# EasyEDA Pro project SCH_and_PCB.epro, board PCB_PCB_电磁感应_2023-06-19
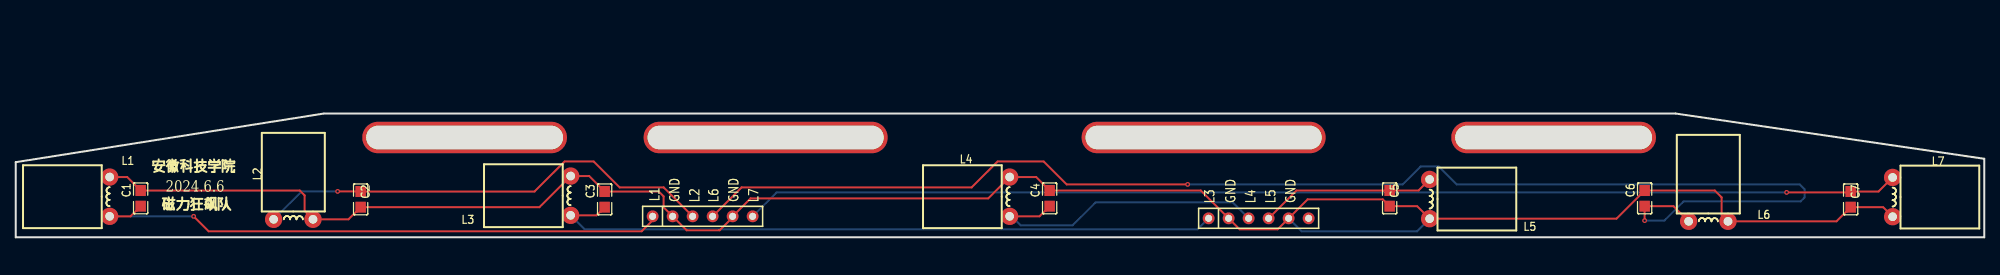
[diagram p6: board, top side]
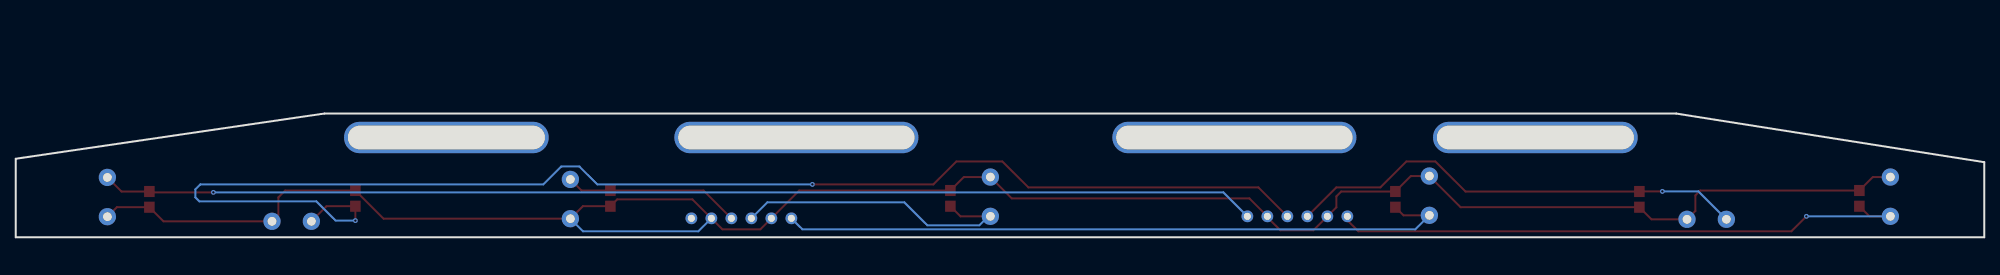
[diagram p7: board, bottom side, seen from below]

Outline 250 x 15.75 mm; copper layers: Top Layer, Bottom Layer. Coordinates in mm from the lower left corner of the outline.
Outline path: 0,9.56 39.11,15.75 210.81,15.75 250,9.99 250,0 0,0 0,9.56
Stack: Top Layer 0.035mm / Dielectric1 1.51mm FR4 er 4.5 / Bottom Layer 0.035mm

## Design rules (mm)
spacing Default (default): track to track 0.152, other pairs 0 to 0.152
track width Default (default): min 0.254, default 0.254, max 25.4
differential pair differentialPair (default): width min 0.127, default 0.254, max 2.54; gap min 0.152, default 0.152
via Default (default): diameter min 0.62, default 0.62, max 100.025; hole min 0.305, default 0.305, max 59.995

## Placement (name value [footprint] x y rotation side)
C1  6.8nF  [C0805]  15.86 4.95 90 top
C2  6.2nF  [C0805]  43.8 4.83 270 top
C3  6.2nF  [C0805]  74.79 4.83 90 top
C4  6.2nF  [C0805]  131.3 4.95 90 top
C5  6.2nF  [C0805]  174.48 4.95 270 top
C6  6.2nF  [C0805]  206.87 4.95 90 top
C7  6.2nF  [C0805]  233.03 4.83 270 top
L1  10mH  [卧式工字电感8*10]  11.92 2.67 180 top
L2  10mH  [卧式工字电感8*10]  32.75 2.29 90 top
L3  10mH  [卧式工字电感8*10]  70.47 2.79 180 top
L4  10mH  [卧式工字电感8*10]  126.22 2.67 180 top
L5  10mH  [卧式工字电感8*10]  179.56 7.37 0 top
L6  10mH  [卧式工字电感8*10]  212.46 2.03 90 top
L7  10mH  [卧式工字电感8*10]  238.36 7.62 0 top
NOREF  -  [Pad_e303]  57.01 12.7 0 top
NOREF#2  -  [Pad_e304]  195.31 12.7 0 top
NOREF#3  -  [Pad_e305]  95.23 12.7 0 top
NOREF#4  -  [Pad_e306]  150.86 12.7 0 top
P1  Header-D-M 1x6P  [HDR1X6-M]  151.5 2.41 0 top
P2  Header-D-M 1x6P  [HDR1X6-M]  80.88 2.67 0 top

## Footprints (pads in the part's own frame, mm; a bottom-side part is the same pattern mirrored in y, then rotated)
C0805
  rect 1.41x1.35 smd: 1(-1,0) 2(1,0)
HDR1X6-M
  round 1.5 hole 0.9: 1(0,0) 2(2.54,0) 3(5.08,0) 4(7.62,0) 5(10.16,0) 6(12.7,0)
Pad_e303
  oval 26x4 hole 25x3: 3(0,0)
Pad_e304
  oval 26x4 hole 25x3: 3(0,0)
Pad_e305
  oval 31x4 hole 30x3: 3(0,0)
Pad_e306
  oval 31x4 hole 30x3: 3(0,0)
卧式工字电感8*10
  round 2.2 hole 1.1: 1(0,0) 2(0,-5)

## Nets
As in the schematic.

Pads without a net: NOREF 3; NOREF#2 3; NOREF#3 3; NOREF#4 3; P1 6

## Via types
v1: diameter 0.62, hole 0.305, Top Layer to Bottom Layer, 5 vias

## Routing (per net, layer and track width the routed paths; a pad name or vN(x,y) marks a point on that pad's centre or on a via; arc(x,y) is an arc through that point)
GND: length 268.9
  Top Layer w0.254: L1.2 14.15,7.67 C1.2 36.07,5.95 36.69,5.33 36.69,3.35 L2.2 42.26,2.29 C2.2 66.5,3.83 L3.2 72.82,7.79 C3.2 81.66,5.83 82.28,5.21 82.28,3.81 P2.2 85.2,0.89 89.39,0.89 91.04,2.54 P2.5 93.33,4.95 123.51,4.95 L4.2 129.59,7.67 C4.2 150.5,5.95 P1.2 155.43,1.02 160.26,1.02 P1.5 164.07,4.83 173.61,4.83 C5.2 177.98,3.95 L5.2 203.28,2.37 C6.2 215.77,5.95 216.65,5.08 216.65,2.84 L6.2 231.24,2.03 C7.2 237.16,3.83 L7.2
  Bottom Layer w0.254: P1.5 163.31,0.76 177.96,0.76 L5.2
L1: length 75.3
  Top Layer w0.254: P2.1 80.88,2.16 79.49,0.76 24.5,0.76 v1(22.59,2.67) ; C1.1 14.57,2.67 L1.1
  Bottom Layer w0.254: L1.1 v1(22.59,2.67)
L2: length 59.2
  Top Layer w0.254: P2.3 82.28,6.35 76.69,6.35 73.39,9.65 69.71,9.65 65.88,5.83 C2.1 43.78,5.84 v1(40.88,5.84)
  Bottom Layer w0.254: v1(40.88,5.84) 36.31,5.84 L2.1
L3: length 87.1
  Top Layer w0.254: L3.1 73.76,2.79 C3.1
  Bottom Layer w0.254: L3.1 72.25,1.02 150.1,1.02 P1.1
L4: length 38.5
  Top Layer w0.254: L4.1 130.02,2.67 C4.1
  Bottom Layer w0.254: P1.3 154.54,4.45 137.15,4.45 134.22,1.52 127.62,1.52 126.48,2.67 L4.1
L5: length 22.5
  Top Layer w0.254: L5.1 178.15,5.95 C5.1 162.66,5.95 P1.4
L6: length 175.7
  Top Layer w0.254: 206.87,2.16 C6.1 210.53,3.95 L6.1 ; P2.4 92.19,6.35 121.4,6.35 124.7,9.65 130.54,9.65 133.46,6.73 v1(148.83,6.73)
  Bottom Layer w0.254: v1(148.83,6.73) 176.13,6.73 178.42,9.02 180.71,9.02 182.99,6.73 226.55,6.73 227.19,6.1 227.19,5.08 226.68,4.57 211.82,4.57 209.37,2.12 v1(206.87,2.12)
L7: length 146.8
  Top Layer w0.254: L7.1 236.57,5.83 C7.1 232.92,5.72 v1(224.9,5.72)
  Bottom Layer w0.254: P2.6 96.63,5.72 v1(224.9,5.72)

## Text on the board
Top Silkscreen Layer: L1 | GND | L2 | L6 | L7 | L3 | L4 | L5 | 安徽科技学院 | 磁力狂飙队 | 2024.6.6
